# Altium project FR4_Wilkinson_Divider.PrjPcb
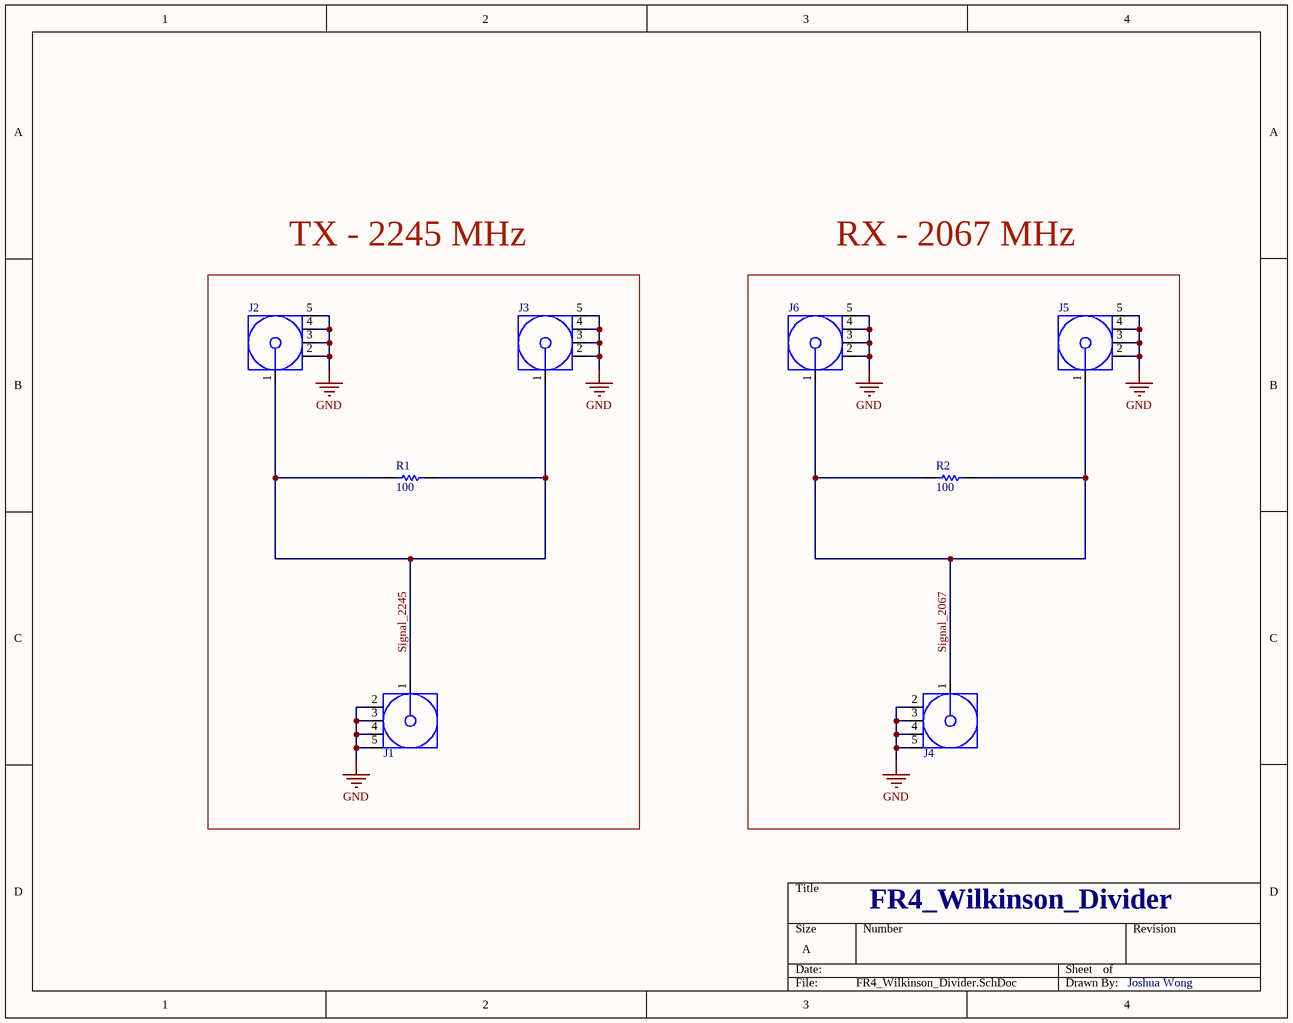
[diagram p0: FR4_Wilkinson_Divider.SchDoc]
1 sheet, 8 parts. Net scope: global (net labels, ports and power ports of the same name join across sheets).
Board file: FR4_Wilkinson_Divider.PcbDoc

## Sheet FR4_Wilkinson_Divider.SchDoc
size A; SheetNumber: 1; SheetTotal: 1

### Parts
J1  0732511150  [FP-0732511150-MFG]  (value not drawn)
J2  0732511150  [FP-0732511150-MFG]  (value not drawn)
J3  0732511150  [FP-0732511150-MFG]  (value not drawn)
J4  0732511150  [FP-0732511150-MFG]  (value not drawn)
J5  0732511150  [FP-0732511150-MFG]  (value not drawn)
J6  0732511150  [FP-0732511150-MFG]  (value not drawn)
R1  value 100  [RES0402R]  (hidden comment: CRCW0402100RFKEE)
R2  value 100  [RES0402R]  (hidden comment: CRCW0402100RFKEE)

### Nets
GND: J1.2(GND) J1.3(GND) J1.4(GND) J1.5(GND) J2.2(GND) J2.3(GND) J2.4(GND) J2.5(GND) J3.2(GND) J3.3(GND) J3.4(GND) J3.5(GND) J4.2(GND) J4.3(GND) J4.4(GND) J4.5(GND) J5.2(GND) J5.3(GND) J5.4(GND) J5.5(GND) J6.2(GND) J6.3(GND) J6.4(GND) J6.5(GND)
Signal_2067: J4.1(Signal) J5.1(Signal) J6.1(Signal) R2.1 R2.2
Signal_2245: J1.1(Signal) J2.1(Signal) J3.1(Signal) R1.1 R1.2

### Notes on the sheet
- TX - 2245 MHz
- RX - 2067 MHz
- FR4_Wilkinson_Divider
- Joshua Wong

### Library data of the parts
J1-J6 = CMP-002-00072-2: RF SMA Connector, 1 Contact(s), Board Mount, Surface Mount Terminal, Locking; Number of Contacts: 1; Characteristic Impedance: 50R; Contact Style: Coax; Mounting Option 1: LOCKING; Termination: SMD/SMT; RoHS Compliant: Yes; Mounting Style: RIGHT ANGLE; Contact Finish - Mating: NOT SPECIFIED; Contact Finish - Termination: Gold (Au) - with Nickel (Ni) barrier; Mounting Technology: Board; Connector Type: SMA; Number of Ports: 1
R1 R2 = CMP-054-000003-6: RES SMD 100 OHM 1% 1/16W 0402; Manufacturer: Vishay Dale; Power: 62.5mW; Rating: AEC-Q200; ComponentLink1URL: https://www.vishay.com/docs/20035/dcrcwe3.pdf; Composition: Thick Film; Tolerance: 1%; Supplier Part Number 1: 541-2953-1-ND; Supplier 1: Digi-Key; PN: CRCW0402100RFKEE; Min Operating Temperature: -55°C; ComponentLink1Description: Datasheet; Max Operating Temperature: 155°C; Case/Package: 0402 (1005 Metric)